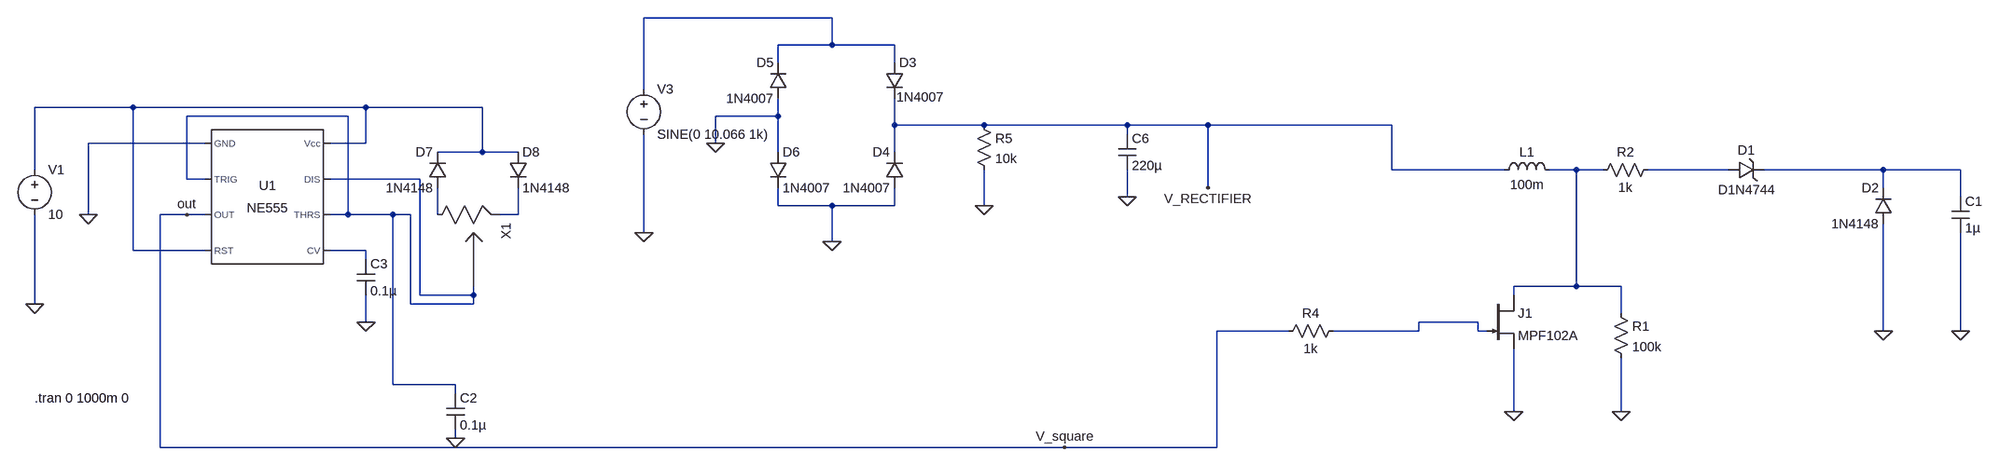
[diagram p0: schematic 555_and_Boost_Converter.asc]
555_and_Boost_Converter.asc, the LTspice schematic file:
Version 4
SHEET 1 2596 680
WIRE -336 -448 -672 -448
WIRE -336 -400 -336 -448
WIRE -336 -400 -432 -400
WIRE -224 -400 -336 -400
WIRE -432 -368 -432 -400
WIRE -224 -368 -224 -400
WIRE -672 -320 -672 -448
WIRE -1648 -288 -1824 -288
WIRE -1232 -288 -1648 -288
WIRE -1024 -288 -1232 -288
WIRE -1264 -272 -1552 -272
WIRE -432 -272 -432 -304
WIRE -432 -272 -544 -272
WIRE -224 -256 -224 -304
WIRE -64 -256 -224 -256
WIRE 192 -256 -64 -256
WIRE 336 -256 192 -256
WIRE 736 -256 336 -256
WIRE 192 -240 192 -256
WIRE -1520 -224 -1728 -224
WIRE -1232 -224 -1232 -288
WIRE -1232 -224 -1296 -224
WIRE -544 -224 -544 -272
WIRE -1024 -208 -1024 -288
WIRE -1024 -208 -1104 -208
WIRE -960 -208 -1024 -208
WIRE -432 -208 -432 -272
WIRE -224 -208 -224 -256
WIRE -1824 -176 -1824 -288
WIRE 736 -176 736 -256
WIRE 1008 -176 736 -176
WIRE 1136 -176 1088 -176
WIRE 1184 -176 1136 -176
WIRE 1408 -176 1264 -176
WIRE 1888 -176 1472 -176
WIRE 2336 -176 1888 -176
WIRE -1552 -160 -1552 -272
WIRE -1520 -160 -1552 -160
WIRE -1136 -160 -1296 -160
WIRE 336 -144 336 -256
WIRE 1888 -144 1888 -176
WIRE 192 -128 192 -176
WIRE 192 -128 176 -128
WIRE 2336 -128 2336 -176
WIRE -432 -112 -432 -144
WIRE -336 -112 -432 -112
WIRE -224 -112 -224 -144
WIRE -224 -112 -336 -112
WIRE -64 -112 -64 -176
WIRE -1728 -96 -1728 -224
WIRE -1552 -96 -1600 -96
WIRE -1520 -96 -1552 -96
WIRE -1264 -96 -1264 -272
WIRE -1264 -96 -1296 -96
WIRE -1184 -96 -1264 -96
WIRE -1152 -96 -1184 -96
WIRE -1104 -96 -1104 -144
WIRE -960 -96 -960 -144
WIRE -960 -96 -992 -96
WIRE -672 -64 -672 -240
WIRE -336 -48 -336 -112
WIRE -1648 -32 -1648 -288
WIRE -1520 -32 -1648 -32
WIRE -1232 -32 -1296 -32
WIRE -1232 -16 -1232 -32
WIRE 1136 32 1136 -176
WIRE 1136 32 1024 32
WIRE 1216 32 1136 32
WIRE -1136 48 -1136 -160
WIRE -1040 48 -1040 32
WIRE -1040 48 -1136 48
WIRE 1024 48 1024 32
WIRE -1824 64 -1824 -96
WIRE -1152 64 -1152 -96
WIRE -1040 64 -1040 48
WIRE -1040 64 -1152 64
WIRE 1216 80 1216 32
WIRE -1232 96 -1232 48
WIRE 960 96 784 96
WIRE 480 112 352 112
WIRE 784 112 784 96
WIRE 784 112 560 112
WIRE 960 112 960 96
WIRE 976 112 960 112
WIRE 1888 112 1888 -80
WIRE 2336 112 2336 -64
WIRE -1184 208 -1184 -96
WIRE -1072 208 -1184 208
WIRE -1072 224 -1072 208
WIRE 1024 256 1024 144
WIRE 1216 256 1216 160
WIRE -1072 304 -1072 288
WIRE -1600 320 -1600 -96
WIRE 80 320 -1600 320
WIRE 352 320 352 112
WIRE 352 320 80 320
FLAG 1024 256 0
FLAG -1728 -96 0
FLAG -1552 -96 out
FLAG -544 -224 0
FLAG -64 -112 0
FLAG 192 -128 0
FLAG -672 -64 0
FLAG -336 -48 0
FLAG -1232 96 0
FLAG 80 320 V_square
FLAG 336 -144 V_RECTIFIER
FLAG 1216 256 0
FLAG -1824 64 0
FLAG -1072 304 0
FLAG 2336 112 0
FLAG 1888 112 0
DATAFLAG -928 320 ""
SYMBOL ind 992 -160 R270
WINDOW 0 32 56 VTop 2
WINDOW 3 5 56 VBottom 2
SYMATTR InstName L1
SYMATTR Value 100m
SYMBOL diode -240 -368 R0
WINDOW 3 19 62 Left 2
SYMATTR Value 1N4007
SYMATTR InstName D3
SYMBOL diode -208 -144 R180
WINDOW 0 24 64 Left 2
WINDOW 3 24 0 Left 2
SYMATTR InstName D4
SYMATTR Value 1N4007
SYMBOL diode -416 -304 R180
WINDOW 0 24 64 Left 2
WINDOW 3 24 0 Left 2
SYMATTR InstName D5
SYMATTR Value 1N4007
SYMBOL diode -448 -208 R0
SYMATTR InstName D6
SYMATTR Value 1N4007
SYMBOL res -80 -272 R0
SYMATTR InstName R5
SYMATTR Value 10k
SYMBOL cap 176 -240 R0
SYMATTR InstName C6
SYMATTR Value 220µ
SYMBOL voltage -672 -336 R0
WINDOW 123 0 0 Left 0
WINDOW 39 0 0 Left 0
SYMATTR InstName V3
SYMATTR Value SINE(0 10.066 1k)
SYMBOL Misc\\NE555 -1408 -128 R0
SYMATTR InstName U1
SYMBOL cap -1248 -16 R0
SYMATTR InstName C3
SYMATTR Value 0.1µ
SYMBOL res 576 96 R90
WINDOW 0 0 56 VBottom 2
WINDOW 3 32 56 VTop 2
SYMATTR InstName R4
SYMATTR Value 1k
SYMBOL njf 976 48 R0
SYMATTR InstName J1
SYMATTR Value MPF102A
SYMBOL res 1200 64 R0
SYMATTR InstName R1
SYMATTR Value 100k
SYMBOL voltage -1824 -192 R0
WINDOW 123 0 0 Left 0
WINDOW 39 0 0 Left 0
SYMATTR InstName V1
SYMATTR Value 10
SYMBOL cap -1088 224 R0
SYMATTR InstName C2
SYMATTR Value 0.1µ
SYMBOL zener 1408 -160 R270
WINDOW 0 36 32 VTop 2
WINDOW 3 -4 32 VBottom 2
SYMATTR InstName D1
SYMATTR Value D1N4744
SYMBOL cap 2320 -128 R0
SYMATTR InstName C1
SYMATTR Value 1µ
SYMBOL res 1280 -192 R90
WINDOW 0 0 56 VBottom 2
WINDOW 3 32 56 VTop 2
SYMATTR InstName R2
SYMATTR Value 1k
SYMBOL diode 1904 -80 R180
WINDOW 0 24 64 Left 2
WINDOW 3 24 0 Left 2
SYMATTR InstName D2
SYMATTR Value 1N4148
SYMBOL diode -1088 -144 R180
WINDOW 0 24 64 Left 2
WINDOW 3 24 0 Left 2
SYMATTR InstName D7
SYMATTR Value 1N4148
SYMBOL diode -976 -208 R0
SYMATTR InstName D8
SYMATTR Value 1N4148
SYMBOL pot -1008 -112 R90
SYMATTR InstName X1
SYMATTR SpiceLine R = 100k val = 99
TEXT -1824 232 Left 2 !.tran 0 1000m 0

The netlist it stands for:
* 555_and_Boost_Converter.asc
L1 V_RECTIFIER N004 100m
D3 N001 V_RECTIFIER 1N4007
D4 0 V_RECTIFIER 1N4007
D5 0 N001 1N4007
D6 0 0 1N4007
R5 V_RECTIFIER 0 10k
C6 V_RECTIFIER 0 220µ
V3 N001 0 SINE(0 10.066 1k)
XU1 0 N003 V_square N002 N009 N003 N003 N002 NE555  ; pins GND TRIG OUT RST CV THRS DIS Vcc
C3 N009 0 0.1µ
R4 N010 V_square 1k
J1 N004 N010 0 MPF102A
R1 N004 0 100k
V1 N002 0 10
C2 N003 0 0.1µ
D1 N005 N006 D1N4744
C1 N006 0 1µ
R2 N005 N004 1k
D2 0 N006 1N4148
D7 N007 N002 1N4148
D8 N002 N008 1N4148
XX1 N008 N003 N007 pot R = 100k val = 99  ; pins 1 2 3
.model D D
.lib standard.dio
.model NJF NJF
.model PJF PJF
.lib standard.jft
.tran 0 1000m 0
.lib NE555.sub
.backanno
.end